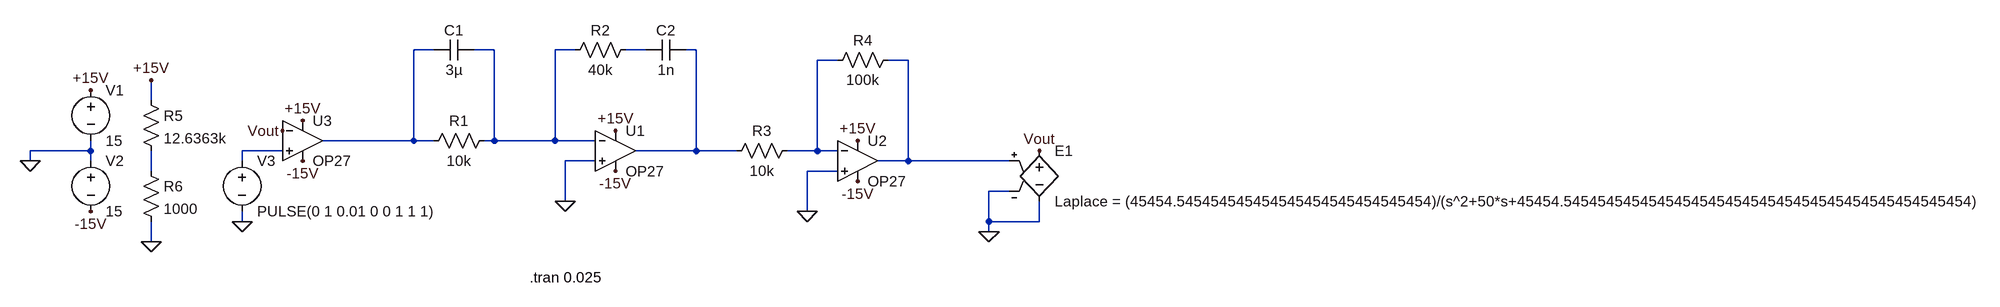
[diagram p0: schematic taller5.asc]
taller5.asc, the LTspice schematic file:
Version 4.1
SHEET 1 2892 852
WIRE -128 96 -160 96
WIRE -32 96 -64 96
WIRE 96 96 64 96
WIRE 208 96 176 96
WIRE 288 96 272 96
WIRE 512 112 480 112
WIRE 624 112 592 112
WIRE -576 176 -576 144
WIRE -160 240 -160 96
WIRE -160 240 -304 240
WIRE -128 240 -160 240
WIRE -32 240 -32 96
WIRE -32 240 -48 240
WIRE 64 240 64 96
WIRE 64 240 -32 240
WIRE 128 240 64 240
WIRE -672 256 -672 240
WIRE -672 256 -768 256
WIRE -368 256 -432 256
WIRE 288 256 288 96
WIRE 288 256 192 256
WIRE 352 256 288 256
WIRE 480 256 480 112
WIRE 480 256 432 256
WIRE 512 256 480 256
WIRE -768 272 -768 256
WIRE -672 272 -672 256
WIRE -432 272 -432 256
WIRE 128 272 80 272
WIRE 624 272 624 112
WIRE 624 272 576 272
WIRE 784 272 624 272
WIRE -576 288 -576 256
WIRE 512 288 464 288
WIRE 784 320 752 320
WIRE 80 336 80 272
WIRE 464 352 464 288
WIRE -432 368 -432 352
WIRE 752 368 752 320
WIRE 832 368 832 336
WIRE 832 368 752 368
WIRE 752 384 752 368
WIRE -576 400 -576 368
FLAG -672 352 -15V
FLAG -672 160 +15V
FLAG -768 272 0
FLAG 160 224 +15V
FLAG 544 240 +15V
FLAG 160 288 -15V
FLAG 544 304 -15V
FLAG 80 336 0
FLAG 464 352 0
FLAG 752 384 0
FLAG 832 256 Vout
FLAG -336 208 +15V
FLAG -336 272 -15V
FLAG -368 224 Vout
FLAG -432 368 0
FLAG -576 144 +15V
FLAG -576 400 0
SYMBOL res -32 224 R90
WINDOW 0 0 56 VBottom 2
WINDOW 3 32 56 VTop 2
SYMATTR InstName R1
SYMATTR Value 10k
SYMBOL cap -64 80 R90
WINDOW 0 0 32 VBottom 2
WINDOW 3 32 32 VTop 2
SYMATTR InstName C1
SYMATTR Value 3µ
SYMBOL voltage -672 144 R0
SYMATTR InstName V1
SYMATTR Value 15
SYMBOL voltage -672 256 R0
SYMATTR InstName V2
SYMATTR Value 15
SYMBOL res 192 80 R90
WINDOW 0 0 56 VBottom 2
WINDOW 3 32 56 VTop 2
SYMATTR InstName R2
SYMATTR Value 40k
SYMBOL cap 272 80 R90
WINDOW 0 0 32 VBottom 2
WINDOW 3 32 32 VTop 2
SYMATTR InstName C2
SYMATTR Value 1n
SYMBOL res 448 240 R90
WINDOW 0 0 56 VBottom 2
WINDOW 3 32 56 VTop 2
SYMATTR InstName R3
SYMATTR Value 10k
SYMBOL res 608 96 R90
WINDOW 0 0 56 VBottom 2
WINDOW 3 32 56 VTop 2
SYMATTR InstName R4
SYMATTR Value 100k
SYMBOL e 832 240 R0
SYMATTR InstName E1
SYMATTR Value Laplace = (45454.545454545454545454545454545454)/(s^2+50*s+45454.545454545454545454545454545454545454545454545454)
SYMBOL OpAmps\\OP27 160 192 R0
SYMATTR InstName U1
SYMBOL OpAmps\\OP27 544 208 R0
SYMATTR InstName U2
SYMBOL OpAmps\\OP27 -336 176 R0
SYMATTR InstName U3
SYMBOL voltage -432 256 R0
WINDOW 123 0 0 Left 0
WINDOW 39 0 0 Left 0
SYMATTR InstName V3
SYMATTR Value PULSE(0 1 0.01 0 0 1 1 1)
SYMBOL res -592 160 R0
SYMATTR InstName R5
SYMATTR Value 12.6363k
SYMBOL res -592 272 R0
SYMATTR InstName R6
SYMATTR Value 1000
TEXT 24 456 Left 2 !.tran 0.025

The netlist it stands for:
* taller5.asc
R1 N002 N001 10k
C1 N002 N001 3µ
V1 +15V 0 15
V2 0 -15V 15
R2 N003 N002 40k
C2 N004 N003 1n
R3 N005 N004 10k
R4 N006 N005 100k
E1 Vout 0 N006 0 Laplace = (45454.545454545454545454545454545454)/(s^2+50*s+45454.545454545454545454545454545454545454545454545454)
X§U1 0 N002 +15V -15V N004 OP27  ; pins In+ In- V+ V- OUT
X§U2 0 N005 +15V -15V N006 OP27  ; pins In+ In- V+ V- OUT
X§U3 N007 Vout +15V -15V N001 OP27  ; pins In+ In- V+ V- OUT
V3 N007 0 PULSE(0 1 0.01 0 0 1 1 1)
R5 +15V N008 12.6363k
R6 N008 0 1000
.tran 0.025
.lib ADI.lib
.backanno
.end